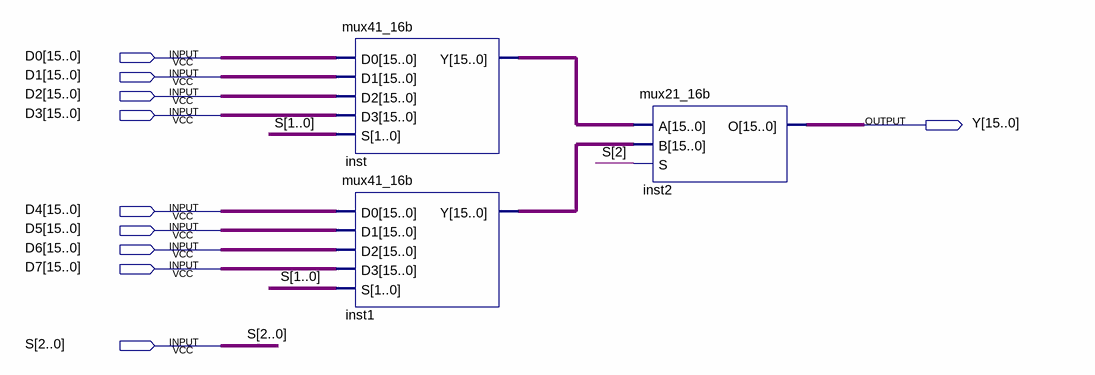
[diagram p0: schematic sheet]
// Quartus schematic mux81_16b.bdf as structural Verilog: 3 symbols, 10 pins
module mux81_16b (
  input  [15:0] D0,
  input  [15:0] D1,
  input  [15:0] D2,
  input  [15:0] D3,
  input  [15:0] D4,
  input  [15:0] D5,
  input  [15:0] D6,
  input  [15:0] D7,
  input  [2:0] S,
  output [15:0] Y
);

  wire [15:0] inst1_y, inst_y;

  mux41_16b inst (.D0(D0), .D1(D1), .D2(D2), .D3(D3), .S(S[1:0]), .Y(inst_y));
  mux41_16b inst1 (.D0(D4), .D1(D5), .D2(D6), .D3(D7), .S(S[1:0]), .Y(inst1_y));
  mux21_16b inst2 (.A(inst_y), .B(inst1_y), .S(S[2]), .O(Y));
endmodule
